# EAGLE design ab (EAGLE 9.6.2)
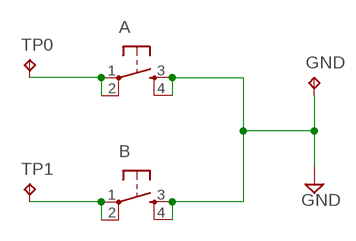
[diagram p0: schematic, sheet 1]

## Parts
A  BUTTON  [SMD_BUTTON]
B  BUTTON  [SMD_BUTTON]
GND  TPPAD1-13  [P1-13]
TP0  TPPAD1-13  [P1-13]
TP1  TPPAD1-13  [P1-13]

## Nets
GND: A.3(S) A.4(S1) B.3(S) B.4(S1) GND.TP
N$1: A.1(P) A.2(P1) TP0.TP
N$3: B.1(P) B.2(P1) TP1.TP

## Library data of the parts
A B = lib:BUTTON: Button; MPN: B3F-1000; OC_FARNELL: 176432; OC_NEWARK: 36M3542
GND TP0 TP1 = testpad:TP: Test pad

## Board
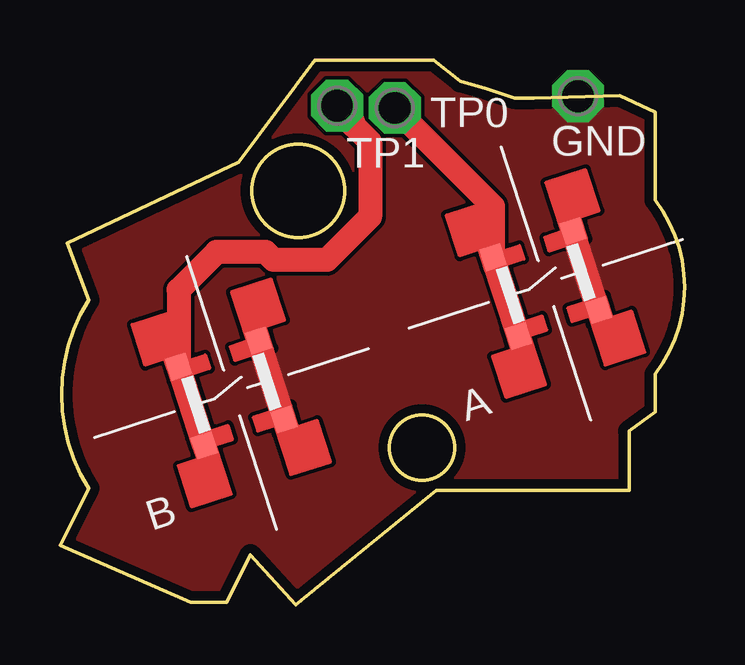
[diagram p1: board, top side]

Size 26.02 x 22.72 mm. Coordinates in mm from the lower left corner, seen from the top.
Outline: 1.19,4.86 arc-64 1.19,12.7 0.3,15.08 7.44,18.45 10.62,22.72 15.58,22.72 16.67,21.83 17.76,21.53 18.95,21.13 19.74,21.13 23.31,21.23 24.8,20.54 24.8,16.87 arc-74 24.8,9.62 24.8,8.04 23.71,7.24 23.71,4.76 15.68,4.76 9.82,0 7.94,2.08 6.94,0.1 5.46,0.1 0,2.48 1.19,4.86
Outline: circle at 15.08,6.55 radius 1.35
Outline: circle at 9.92,17.26 radius 1.93
Copper layers (1*16): Top 0.035mm / dielectric 1.5mm / Bottom 0.035mm
Design rules "default *": minimum track width 6mil, minimum drill 0.35mm, track to track 6mil, track to pad 6mil, pad to pad 6mil, via to via 6mil, smd to smd 6mil, copper to edge 15mil, drill to drill 6mil, minimum pad ring 10mil, minimum via ring 8mil, stop-mask expansion 4mil, vias tented up to drill 0mil, thermal gap 10mil

### Footprints (pad centres in the part's own frame; a part is rotated, then mirrored left to right if it is on the bottom)
SMD_BUTTON = smd 0.95 x 0.9: 1 -1.725,1.75; 2 1.725,1.75; 3 -1.725,-1.75; 4 1.725,-1.75
P1-13 = drill 1.321 pad 2.159 octagon: TP 0,0

### Placement (x,y rotation side)
A  20.24,13.39 108 top
B  7.14,8.83 108 top
GND  21.59,21.21 0 top
TP0  13.95,20.72 0 top
TP1  11.55,20.82 0 top

### Tracks (layer width: path | path; a pad name or v marks a point on that pad's centre or on a via)
GND
  Top 1: A.3 A.4 | B.3 B.4
  pour Top: 5.46,0.1 0,2.48 1.19,4.86 arc-64 1.19,12.7 0.3,15.08 7.44,18.45 10.62,22.72 15.58,22.72 16.67,21.83 17.76,21.53 18.95,21.13 19.74,21.13 23.31,21.23 24.8,20.54 24.8,16.87 arc-74 24.8,9.62 24.8,8.04 23.71,7.24 23.71,4.76 15.68,4.76 9.82,0 7.94,2.08 6.94,0.1
  pour Top (no thermals): 20.12,20.31 23.12,20.31 22.12,19.31 21.62,19.31 21.12,19.31
N$1
  Top 1: A.1 A.2 18.04,16.62 TP0.TP
N$3
  Top 1: B.1 B.2 4.94,13.13 6.52,14.71 8.57,14.71 8.9,14.38 11.12,14.38 12.92,16.19 12.92,19.29 12.22,20 12.22,20.15 TP1.TP

### Text on the board
bNames: AGB_TACT_ab_V2.0
200bmp: C:/Users/imax/Desktop/scan_resampled2.bmp